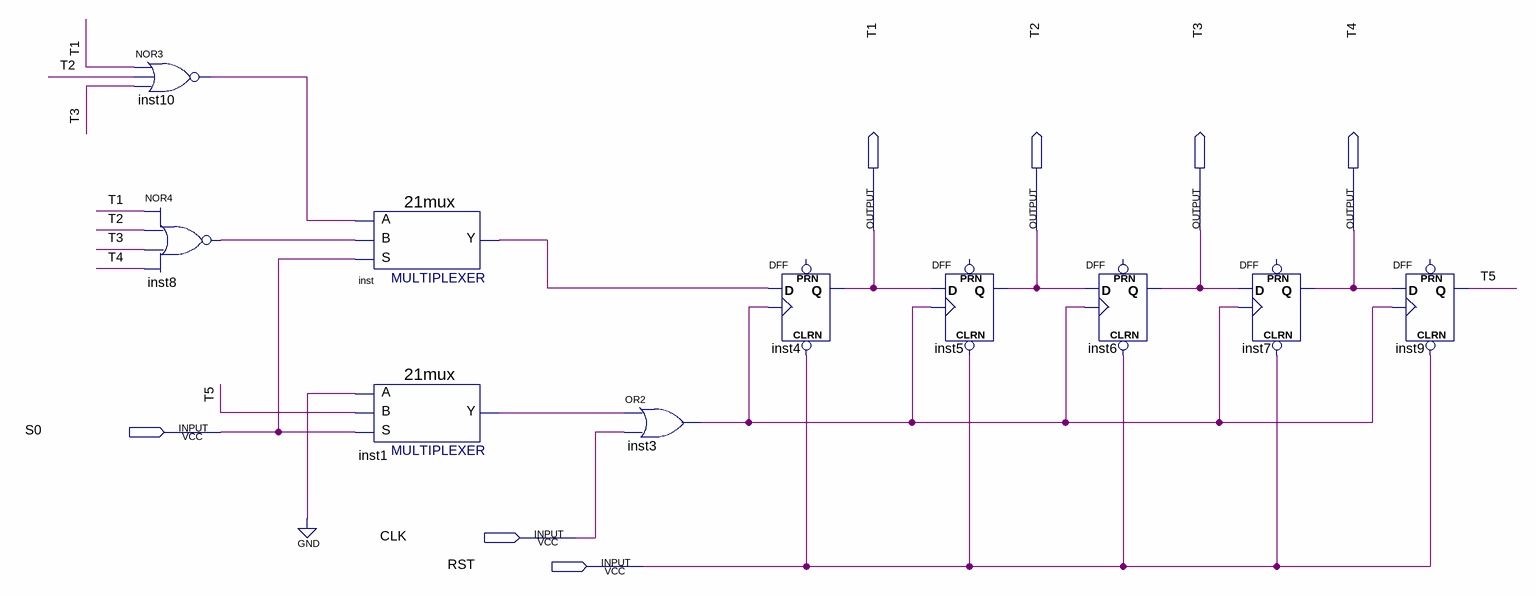
[diagram p0: schematic sheet]
// Quartus schematic pulse.bdf as structural Verilog: 10 symbols, 7 pins
module pulse (
  input  S0,
  input  CLK,
  input  RST,
  output T1,
  output T2,
  output T3,
  output T4
);

  wire inst1_y, inst3_out, inst8_out, inst10_out, inst_y, T5;

  nor inst10 (inst10_out, T1, T2, T3);
  nor inst8 (inst8_out, T1, T2, T3, T4);
  \21mux  inst (.S(S0), .B(inst8_out), .A(inst10_out), .Y(inst_y));
  \21mux  inst1 (.S(S0), .B(T5), .A(1'b0), .Y(inst1_y));
  or inst3 (inst3_out, inst1_y, CLK);
  DFF inst4 (.CLRN(RST), .CLK(inst3_out), .D(inst_y), .Q(T1));  // open: PRN
  DFF inst5 (.CLRN(RST), .CLK(inst3_out), .D(T1), .Q(T2));  // open: PRN
  DFF inst6 (.CLRN(RST), .CLK(inst3_out), .D(T2), .Q(T3));  // open: PRN
  DFF inst7 (.CLRN(RST), .CLK(inst3_out), .D(T3), .Q(T4));  // open: PRN
  DFF inst9 (.CLRN(RST), .CLK(inst3_out), .D(T4), .Q(T5));  // open: PRN
endmodule
